# Altium schematic sheet ESP32_Sch.SchDoc
size A; PageSetup: Record=PageOptions|CenterHorizontal=True|CenterVertical=True|PrintScale=1.00|XCorrection=1.00|YCorrection=1.00|PrintKind=1|BorderSize=5000000|LeftOffset=0|BottomOffset=0|Orientation=2|PaperLength=1000|PaperWidth=1000|Scale=100|PaperSource=7|PrintQuality=-3|MediaType=1|DitherType=10|PrintScaleMode=0|PaperKind=A4|PaperIndex=9
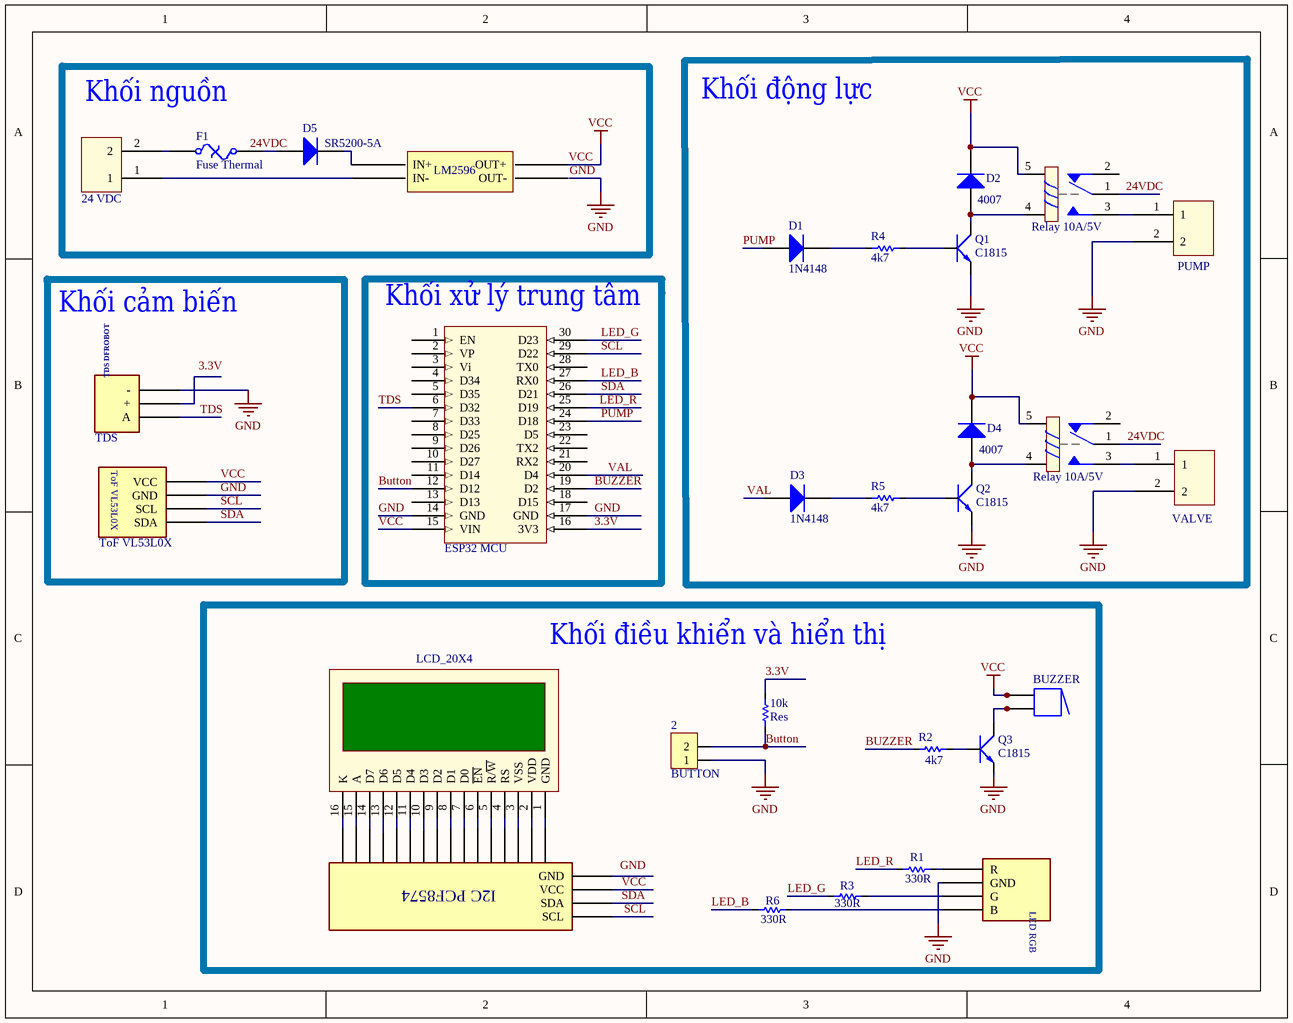
[diagram p0: ESP32_Sch.SchDoc]

## Parts
(Parts that share a designator on the sheet are numbered #1, #2 ... from top to bottom, then left to right.)
2  BUTTON  [HDR2]
10k  Res  [RES-1/4W]
*#1  TDS
*#2  ToF VL53L0X
*#3  LED RGB  (value not drawn)
?  I2C_PCF8574  (value not drawn)
BUZZER  (no value)  [ABSM-1574]
CN1  PUMP  [HB9500]
CN2  VALVE  [HB9500]
CN3  24 VDC  [HB9500]
D1  1N4148  [DO-41]
D2  4007  [DO-41]
D3  1N4148  [DO-41]
D4  4007  [DO-41]
D5  SR5200-5A  [DO-201AD]
F1  Fuse Thermal  [PIN-W2/E2.8]
L1  BUCK_LM2596  [BUCK_LM2596]  (value not drawn)
LCD_20X4  (no value)  [LCD20X4A]
Q1  C1815  [TO92-123]
Q2  C1815  [TO92-123]
Q3  C1815  [TO92-123]
R1  330R  [RES-1/4W]
R2  4k7  [RES-1/4W]
R3  330R  [RES-1/4W]
R4  4k7  [RES-1/4W]
R5  4k7  [RES-1/4W]
R6  330R  [RES-1/4W]
RL1  Relay 10A/5V  [RELAY SMALL]
RL2  Relay 10A/5V  [RELAY SMALL]
U2  ESP32 MCU  [Model Name]

## Blocks framed on the sheet
Khối nguồn: CN3 D5 F1 L1
Khối động lực: CN1 CN2 D1-D4 Q1 Q2 R4 R5 RL1 RL2
Khối điều khiển và hiển thị: 2 10k *#3 ? BUZZER LCD_20X4 Q3 R1-R3 R6

## Nets
GND: 2.1 *#1.SCL(-) *#2.3(GND) *#3.3(GND) CN1.2 CN2.2 Q1.1(E) Q2.1(E) Q3.1(E) U2.14(GND) U2.17(GND)
VCC: *#2.2(VCC) ?.2(VCC) BUZZER.1 BUZZER.1A D2.2(K) D4.2(K) L1.4(OUT+) RL1.5 RL2.5 U2.15(VIN)
3.3V: 10k.1 U2.16(3V3)
24VDC: RL1.1 RL2.1
Button: 2.2 10k.2 U2.12(D12)
BUZZER: R2.2 U2.19(D2)
LED_B: R6.2 U2.27(RX0)
LED_G: R3.2 U2.30(D23)
LED_R: R1.2 U2.25(D19)
PUMP: D1.1(A) U2.24(D18)
SCL: *#2.SCL ?.SCL U2.29(D22)
SDA: *#2.1(SDA) ?.1(SDA) U2.26(D21)
TDS: *#1.2(A) U2.6(D32)
VAL: D3.1(A) U2.20(D4)
Net*#3_1: *#3.1(B) R6.1
Net*#3_2: *#3.2(R) R1.1
Net*#3_SCL: *#3.SCL(G) R3.1
NetBUZZER_2: BUZZER.2 BUZZER.2A Q3.2(C)
NetCN1_1: CN1.1 RL1.3
NetCN2_1: CN2.1 RL2.3
NetCN3_1: CN3.1 L1.2(IN-)
NetCN3_2: CN3.2 F1.1
NetD1_2: D1.2(K) R4.1
NetD2_1: D2.1(A) Q1.2(C) RL1.4
NetD3_2: D3.2(K) R5.1
NetD4_1: D4.1(A) Q2.2(C) RL2.4
NetD5_1: D5.1(A) F1.2
NetD5_2: D5.2(K) L1.1(IN+)
NetQ1_3: Q1.3(B) R4.2
NetQ2_3: Q2.3(B) R5.2
NetQ3_3: Q3.3(B) R2.1

Not connected (* = marked no-connect by the designer): *#1 3(+); ? 3(GND) ?1 ?2 ?3 ?4 ?5 ?6 ?7 ?8 ?9 ?10 ?11 ?12 ?13 ?14 ?15 ?16; L1 3(OUT-); LCD_20X4 1(GND) 2(VDD) 3(VSS) 4(RS) 5(R/~{W}) 6(~{EN}) 7(D0) 8(D1) 9(D2) 10(D3) 11(D4) 12(D5) 13(D6) 14(D7) 15(A) 16(K); RL1 2; RL2 2; U2 1(EN) 2(VP) 3(Vi) 4(D34) 5(D35) 7(D33) 8(D25) 9(D26) 10(D27) 11(D14) 13(D13) 18(D15) 21(RX2) 22(TX2) 23(D5) 28(TX0)

## Notes on the sheet
- Khối cảm biến
- (near U2) Khối xử lý trung tâm
- Labels drawn without touching a wire or pin: 3.3V, 24VDC, GND
- (in symbol BUCK_LM2596) LM2596
- (in symbol I2C_PCF8574) I2C PCF8574
- (in symbol TDS) TDS DFROBOT

## Library data of the parts
2 = Header2: Header IDC, 2 x 1 Pin Vertical 2.54mm Pitch (Non-Boxed, Male); Manufacturer: W¨¹rth Elektronik eiSos GmbH; partNo: 613002143121; ComponentLink1 Description: Manufacturer; ComponentLink2 Description: Datasheet; NoPins: 02; Created Date: 29 March 2013; ComponentLink1URL: http://www.we-online.com; ComponentLink2URL: http://katalog.we-online.de/em/datasheet/6130xx143121.pdf; Created by: Karrer Zheng
10k R1-R6 = Res: Manufacturer: Generic Components; Class: Passive; SubClass: R; Published: 08/06/2000; Publisher: Altium Hobart Technology Centre
BUZZER = Buzzer: Magnetic Transducer Buzzer; Published: 24-Mar-1999; LatestRevisionDate: 17-Dec-2003; LatestRevisionNote: Schematic revised, PCB Footprint replaced.; DatasheetVersion: 17-Dec-2003; PackageReference: ABSM-1574; Publisher: Altium Limited; PackageDescription: Magnetic Transducer Buzzer; ComponentLink1Description: Manufacturer Link; ComponentLink1URL: http://www.megastar.com/linecard/buzzmode/index.php
CN1-CN3 = Domino2
D1-D4 = Diode 1N4007: 1 Amp General Purpose Rectifier; Published: 8-Jun-2000; LatestRevisionDate: 17-Jul-2002; LatestRevisionNote: Re-released for DXP Platform.; DatasheetVersion: 1998; PackageVersion: Aug-1999; PackageReference: DO-41; Publisher: Altium Limited; PackageDescription: Diode, Axial; Body 5.2 x 2.7 mm (LxDia. max), Lead Dia. 0.86 mm (max); Code_JEDEC: DO-204-AL; ComponentLink1Description: Manufacturer Link; ComponentLink1URL: http://www.fairchildsemi.com/; ComponentLink2Description: Datasheet; ComponentLink2URL: http://www.fairchildsemi.com/ds/1N%2F1N4001.pdf
D5 = Diode 1N5408: 3 Amp Medium Power Silicon Rectifier Diode; Published: 8-Jun-2000; LatestRevisionDate: 17-Jul-2002; LatestRevisionNote: Re-released for DXP Platform.; DatasheetVersion: Aug-1984; PackageReference: DO-201AD; Publisher: Altium Limited; PackageDescription: Diode, Axial; Body 9.5 x 5.3 mm (LxDia. max), Lead Dia. 1.32 mm (max); ComponentLink1Description: Manufacturer Link; ComponentLink1URL: http://www.irf.com/
F1 = Fuse Thermal: Thermal Fuse; Published: 24-Mar-1999; LatestRevisionDate: 17-Jul-2002; LatestRevisionNote: Re-released for DXP Platform.; PackageReference: PIN-W2/E2.8; Publisher: Altium Limited; PackageDescription: Thru-Hole; 2 Leads
LCD_20X4 = LCD20x4A: LCD dipslay 20 char, 4 line; Value: Jum 40; Value: LCD 20x4A
Q1-Q3 = C1815: NPN 600mW, ECB; Value: C1815
RL1 RL2 = Relay 5: Relay SPDT,10A - 12VDC 5 Pin; Value: Relay SPDT, 10A, 12V
U2 = ESP8266 MCU